# EAGLE design Centipedes (EAGLE 9.6.2)
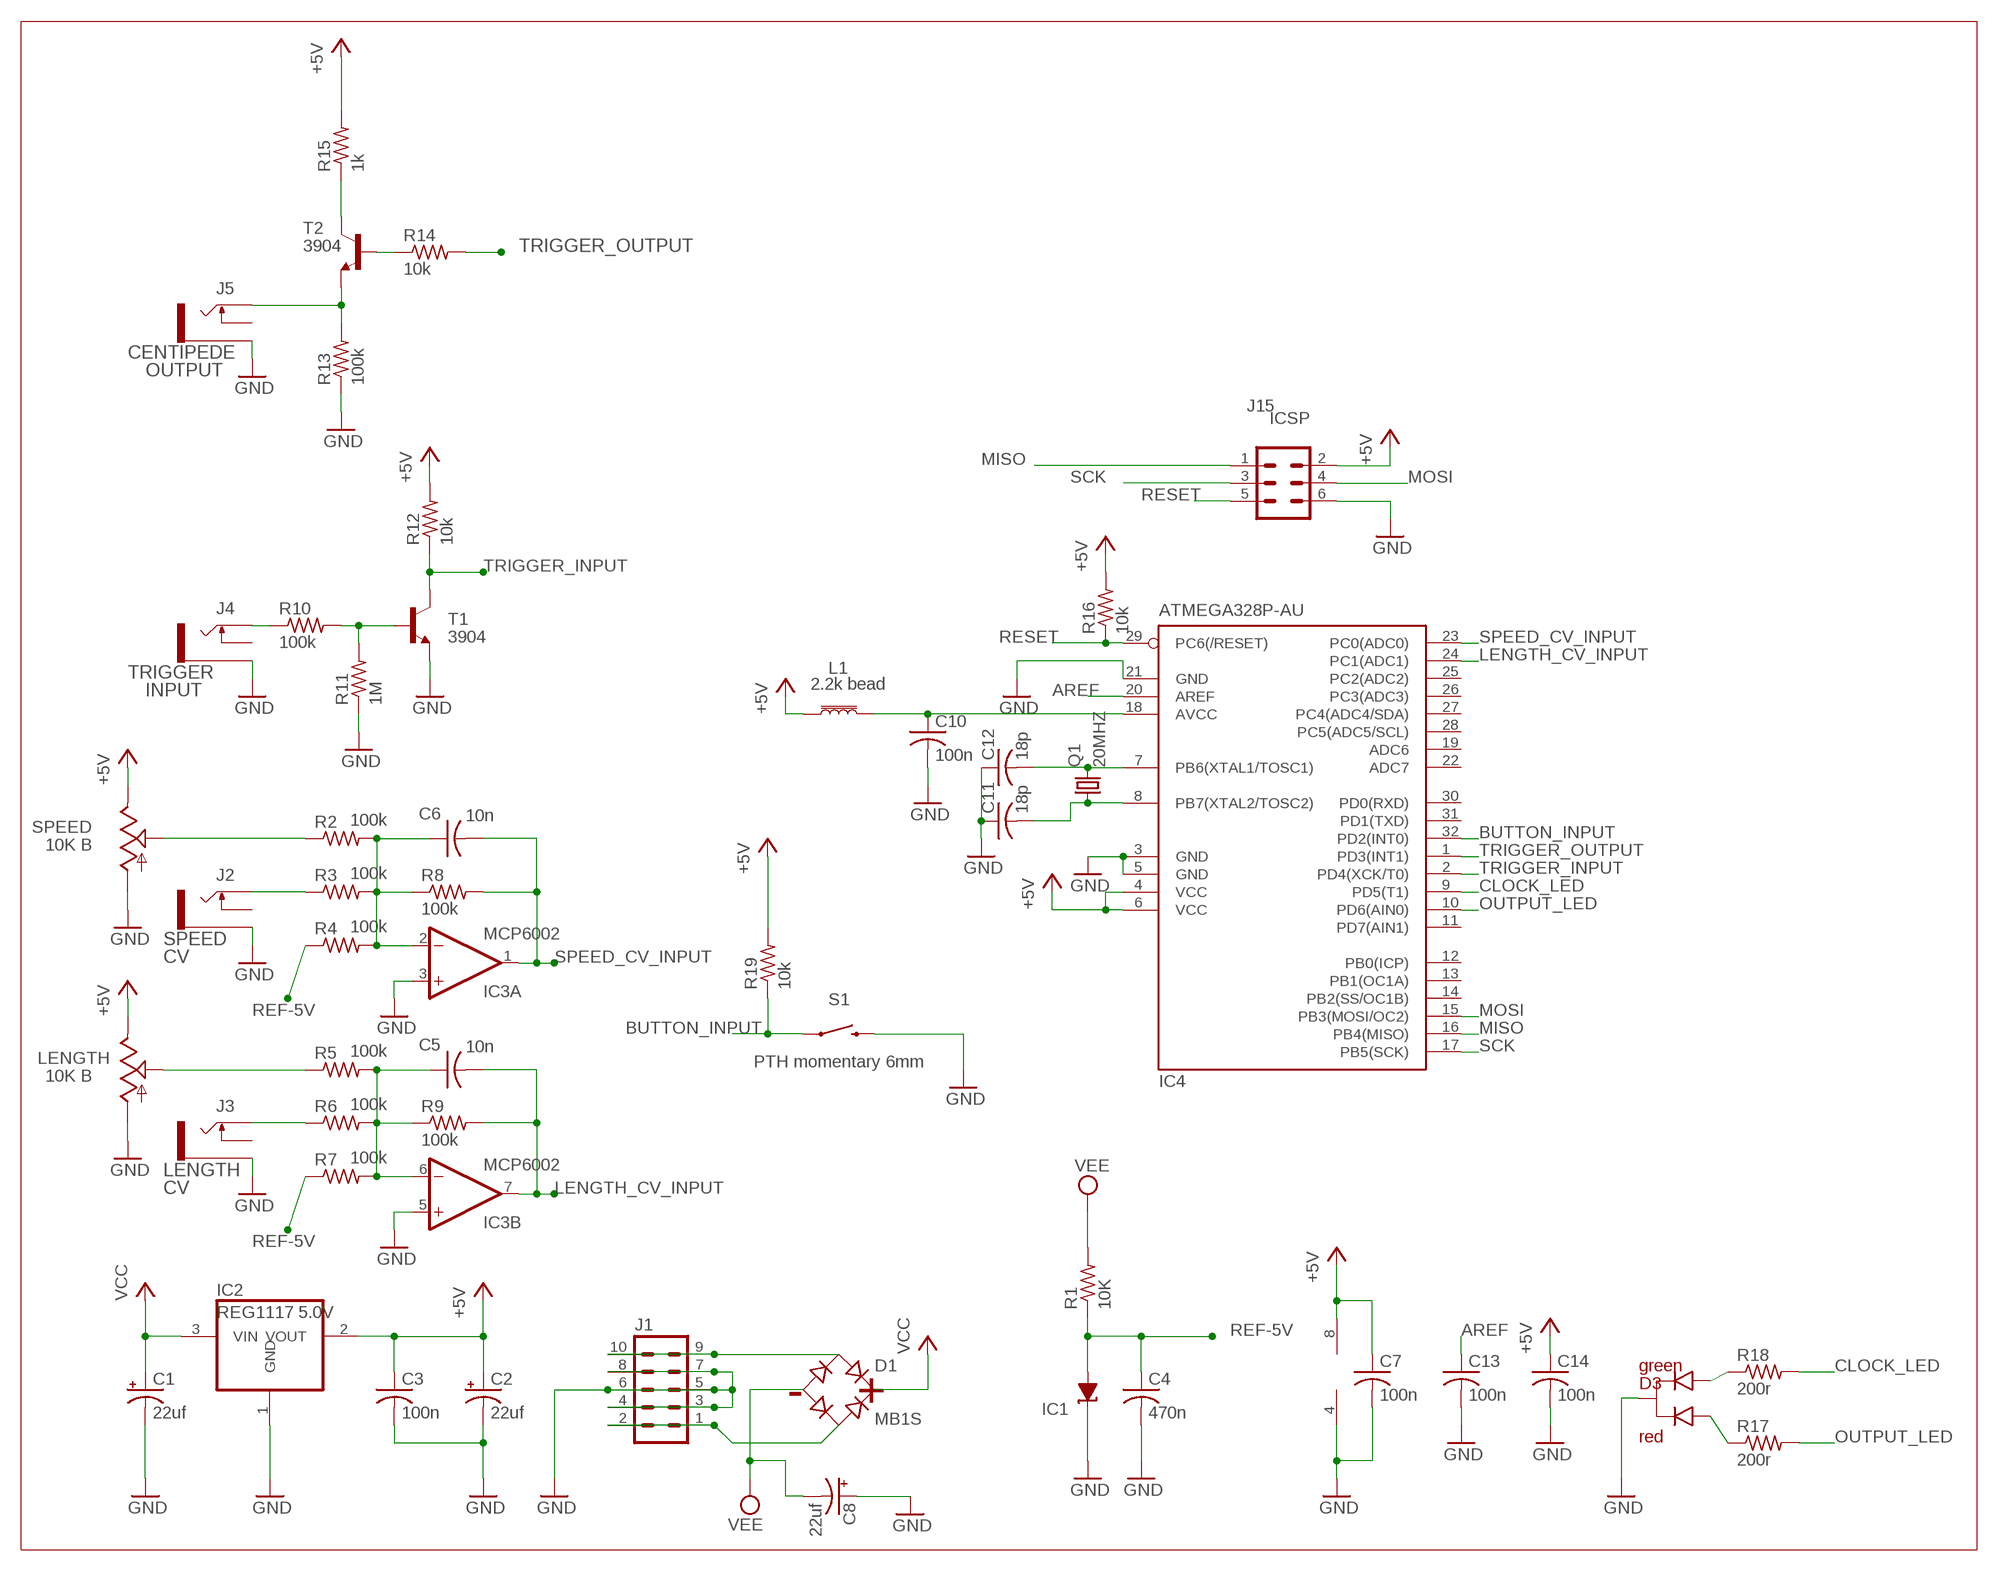
[diagram p0: schematic, sheet 1]

## Parts
C1  22uf  CPOL-USC  [PANASONIC_C]
C2  22uf  CPOL-USC  [PANASONIC_C]
C3  100n  C-USC0603K  [C0603K]
C4  470n  C-USC0603K  [C0603K]
C5  10n  C-USC0603K  [C0603K]
C6  10n  C-USC0603K  [C0603K]
C7  100n  C-USC0603K  [C0603K]
C8  22uf  CPOL-USC  [PANASONIC_C]
C10  100n  C-USC0603K  [C0603K]
C11  18p  C-USC0603K  [C0603K]
C12  18p  C-USC0603K  [C0603K]
C13  100n  C-USC0603K  [C0603K]
C14  100n  C-USC0603K  [C0603K]
D1  MB1S  [SOIC-4]
D3  LED-DUALCOLOR3MM-THROUGH-HOLE  [LED-DUALCOLOR-3MM]
IC1  LM4041A12DBZ  [DBZ_R-PDSO-G3]
IC2  REG1117 5.0V  REG1117  [SOT223]
IC3  MCP6002  MCP6002_  [SO08]
IC4  ATMEGA328P-AU  MEGA8-AI  [TQFP32-08]
J1  MA05-2  [MA05-2]
J2  THONKICONNNEW  [WQP-PJ301M-12_JACK]
J3  THONKICONNNEW  [WQP-PJ301M-12_JACK]
J4  THONKICONNNEW  [WQP-PJ301M-12_JACK]
J5  THONKICONNNEW  [WQP-PJ301M-12_JACK]
J15  ICSP  MA03-2  [MA03-2]
L1  2.2k bead  FERRITE_BEAD-0603  [0603]
LENGTH  10K B  9MM_SNAP-IN_POT_  [9MM_SNAP-IN_POT]
Q1  20MHZ  CRYSTALHC49UP  [HC49UP]
R1  10K  R-US_R0603  [R0603]
R2  100k  R-US_R0603  [R0603]
R3  100k  R-US_R0603  [R0603]
R4  100k  R-US_R0603  [R0603]
R5  100k  R-US_R0603  [R0603]
R6  100k  R-US_R0603  [R0603]
R7  100k  R-US_R0603  [R0603]
R8  100k  R-US_R0603  [R0603]
R9  100k  R-US_R0603  [R0603]
R10  100k  R-US_R0603  [R0603]
R11  1M  R-US_R0603  [R0603]
R12  10k  R-US_R0603  [R0603]
R13  100k  R-US_R0603  [R0603]
R14  10k  R-US_R0603  [R0603]
R15  1k  R-US_R0603  [R0603]
R16  10k  R-US_R0603  [R0603]
R17  200r  R-US_R0603  [R0603]
R18  200r  R-US_R0603  [R0603]
R19  10k  R-US_R0603  [R0603]
S1  PTH momentary 6mm  MOMENTARY-SWITCH-SPST-PTH-6.0MM  [TACTILE_SWITCH_PTH_6.0MM]
SPEED  10K B  9MM_SNAP-IN_POT_  [9MM_SNAP-IN_POT]
T1  3904  MMBT3904LT1-NPN-SOT23-BEC  [SOT23-BEC]
T2  3904  MMBT3904LT1-NPN-SOT23-BEC  [SOT23-BEC]

## Nets
+5V: C2.+ C3.1 C7.1 C14.1 IC2.2(VOUT) IC3.8(P:V+) IC4.4(VCC) IC4.6(VCC) J15.2 L1.1 LENGTH.3(E) R12.2 R15.2 R16.2 R19.2 SPEED.3(E)
AREF: C13.1 IC4.20(AREF)
BUTTON_INPUT: IC4.32(PD2(INT0)) R19.1 S1.1
CLOCK_LED: IC4.9(PD5(T1)) R18.2
GND: C1.- C2.- C3.2 C4.2 C7.2 C8.+ C10.2 C11.1 C12.1 C13.2 C14.2 D3.K IC1.1(C) IC2.1(GND) IC3.3(A:+IN) IC3.4(P:V-) IC3.5(B:+IN) IC4.3(GND) IC4.5(GND) IC4.21(GND) J1.3 J1.4 J1.5 J1.6 J1.7 J1.8 J2.P$3_SLEEVE(SLEEVE) J3.P$3_SLEEVE(SLEEVE) J4.P$3_SLEEVE(SLEEVE) J5.P$3_SLEEVE(SLEEVE) J15.6 LENGTH.1(A) R11.1 R13.1 S1.3 SPEED.1(A) T1.E
LENGTH_CV_INPUT: C5.2 IC3.7(B:OUT) IC4.24(PC1(ADC1)) R9.2
MISO: IC4.16(PB4(MISO)) J15.1
MOSI: IC4.15(PB3(MOSI/OC2)) J15.4
N$1: LENGTH.2(S) R5.1
N$2: C5.1 IC3.6(B:-IN) R5.2 R6.2 R7.2 R9.1
N$3: J3.P$1_TIP(TIP) R6.1
N$4: D1.~2(AC2) J1.1 J1.2
N$5: D1.~1(AC1) J1.9 J1.10
N$6: J4.P$1_TIP(TIP) R10.1
N$7: C6.1 IC3.2(A:-IN) R2.2 R3.2 R4.2 R8.1
N$8: R10.2 R11.2 T1.B
N$9: J2.P$1_TIP(TIP) R3.1
N$10: R2.1 SPEED.2(S)
N$11: J5.P$1_TIP(TIP) R13.2 T2.E
N$12: R15.1 T2.C
N$13: R14.1 T2.B
N$14: C12.2 IC4.7(PB6(XTAL1/TOSC1)) Q1.2
N$15: C11.2 IC4.8(PB7(XTAL2/TOSC2)) Q1.1
N$16: D3.A1 R18.1
N$17: C10.1 IC4.18(AVCC) L1.2
N$18: D3.A2 R17.1
OUTPUT_LED: IC4.10(PD6(AIN0)) R17.2
REF-5V: C4.1 IC1.2(A) R1.1 R4.1 R7.1
RESET: IC4.29(PC6(/RESET)) J15.5 R16.1
SCK: IC4.17(PB5(SCK)) J15.3
SPEED_CV_INPUT: C6.2 IC3.1(A:OUT) IC4.23(PC0(ADC0)) R8.2
TRIGGER_INPUT: IC4.2(PD4(XCK/T0)) R12.1 T1.C
TRIGGER_OUTPUT: IC4.1(PD3(INT1)) R14.2
VCC: C1.+ D1.+ IC2.3(VIN)
VEE: C8.- D1.- R1.2
Unconnected: IC4.11(PD7(AIN1)) IC4.12(PB0(ICP)) IC4.13(PB1(OC1A)) IC4.14(PB2(SS/OC1B)) IC4.19(ADC6) IC4.22(ADC7) IC4.25(PC2(ADC2)) IC4.26(PC3(ADC3)) IC4.27(PC4(ADC4/SDA)) IC4.28(PC5(ADC5/SCL)) IC4.30(PD0(RXD)) IC4.31(PD1(TXD)) J2.P$2_SWITCH(SWITCH) J3.P$2_SWITCH(SWITCH) J4.P$2_SWITCH(SWITCH) J5.P$2_SWITCH(SWITCH)

## Notes on the sheet
- CENTIPEDE
- OUTPUT
- TRIGGER
- INPUT
- SPEED
- CV
- LENGTH
- CV
- - | green
- D3
- +
- red

## Library data of the parts
C1 C2 C8 = rcl:CPOL-US: POLARIZED CAPACITOR, American symbol; SPICEPREFIX: C
C3-C7 C10-C14 = rcl:C-US: CAPACITOR, American symbol; SPICEPREFIX: C
D1 = rectifier:MB*S: Bridge Rectifier Source: http://www.fairchildsemi.com/ds/MB/MB6S.pdf
D3 = User-Submitted:LED-DUALCOLOR
IC1 = texas:LM4041: PRECISION MICROPOWER SHUNT VOLTAGE REFERENCE Source: http://focus.ti.com/lit/ds/slcs146e/slcs146e.pdf; MPN: LM4041A12IDBZR; OC_FARNELL: 1407949; OC_NEWARK: 58K5875
IC2 = burr-brown:REG1117: 800mA and 1A Low Dropout (LDO) Positive Regulator 1.8V, 2.5V, 2.85V, 3.3V, 5V, and Adj; MPN: REG1117; OC_FARNELL: 1097566; OC_NEWARK: 14P6981
IC3 = MusicThingModular:MCP6002: Generic Dual Op Amp
IC4 = atmel:MEGA8: MICROCONTROLLER 8 Kbytes FLASH, 1 kbytes SRAM, 512 bytes EEPROM, USART, 6-channel 10 bit ADC, 2-channel 8 bit ADC Pin compatible with Atmega48, ATMega88, ATMega168 Source: avr.lbr; MPN: ATMEGA8-16AU; OC_FARNELL: 9171371; OC_NEWARK: 73M8863
J1 = con-lstb:MA05-2: PIN HEADER; OC_FARNELL: unknown; OC_NEWARK: unknown
J2-J5 = MusicThingModular:THONKICONN: 3.5mm socket for Eurorack modular synths
J15 = con-lstb:MA03-2: PIN HEADER; OC_FARNELL: unknown; OC_NEWARK: unknown
L1 = SparkFun-Coils:FERRITE_BEAD: Ferrite Bead (blocks, cores, rings, chokes, etc.) Inductor with layers of ferrite used to suppress high frequencies. Often used to isolate high frequency noise. SparkFun Products: IOIO-OTG - V2.2 <https://www.sparkfun.com/products/13613> SparkFun SAMD21 Mini Breakout <https://www.sparkfun.com/products/13664> SparkFun 6 Degrees of Freedom Breakout - LSM6DS3 <https://www.sparkfun.com/products/13339> SparkFun SAMD21 Dev Breakout <https://www.sparkfun.com/products/13672> Lilypad MP3 <https://www.sparkfun.com/products/11013>; PROD_ID: NDUC-13805; VALUE: 30Ω/1.8A
LENGTH SPEED = MusicThingModular:9MM_SNAP-IN_POT: 9mm vertical snap-in pot, Alpha / Panasonic style
Q1 = crystal:CRYSTAL: CRYSTAL; OC_FARNELL: unknown; OC_NEWARK: unknown
R1-R19 = rcl:R-US_: RESISTOR, American symbol; SPICEPREFIX: R
S1 = SparkFun-Switches:MOMENTARY-SWITCH-SPST: Momentary Switch (Pushbutton) - SPST Normally-open (NO) SPST momentary switches (buttons, pushbuttons). Variants PTH-12MM - 12mm square, through-hole Momentary Pushbutton Switch - 12mm Square <https://www.sparkfun.com/products/9190> (COM-09190) PTH-6.0MM, PTH-6.0MM-KIT - 6.0mm square, through-hole Mini Pushbutton Switch <https://www.sparkfun.com/products/97> (COM-00097) KIT package intended for soldering kit's - only one side of pads' copper is exposed. PTH-RIGHT-ANGLE-KIT - Right-angle, through-hole Right Angle Tactile Button <https://www.sparkfun.com/products/10791> - Used on SparkFun BigTime Watch Kit <https://www.sparkfun.com/products/11734> SMD-12MM - 12mm square, surface-mount Tactile Button - SMD (12mm) <https://www.sparkfun.com/products/12993> (COM-12993) Used on SparkFun PicoBoard <https://www.sparkfun.com/products/11888> SMD-4.5MM - 4.5mm Square Trackball Switch Used on SparkFun Blackberry Trackballer Breakout <https://www.sparkfun.com/products/13169> SMD-4.6MMX2.8MM - 4.60mm x 2.80mm, surface mount Used on SparkFun Pro Micro - RP2040 <https://www.sparkfun.com/products/17717> SMD-5.2MM, SMD-5.2-REDUNDANT - 5.2mm square, surface-mount Mini Pushbutton Switch - SMD <https://www.sparkfun.com/products/8720> (COM-08720) Used on Arduino Pro Mini <https://www.sparkfun.com/products/11114> REDUNDANT package connects both switch circuits together SMD-6.0X3.5MM - 6.0 x 3.5mm, surface mount Momentary Reset Switch SMD <https://www.sparkfun.com/products/8229> (COM-08229) SMD-6.2MM-TALL - 6.2mm square, surface mount Tactile Button - SMD (6mm) <https://www.sparkfun.com/products/12992> Used on SparkFun Digital Sandbox <https://www.sparkfun.com/products/12651> SMD-RIGHT-ANGLE - Right-angle, surface mount Used on SparkFun Block for Intel® Edison - Arduino <https://www.sparkfun.com/products/13036>; PROD_ID: SWCH-08441; SF_SKU: COM-00097
T1 T2 = MusicThingModular:*-NPN-: NPN Transistror BF959 corrected 2008.03.06

## Module WP115VEGW
Ports: 

### Library data of the parts

## Board
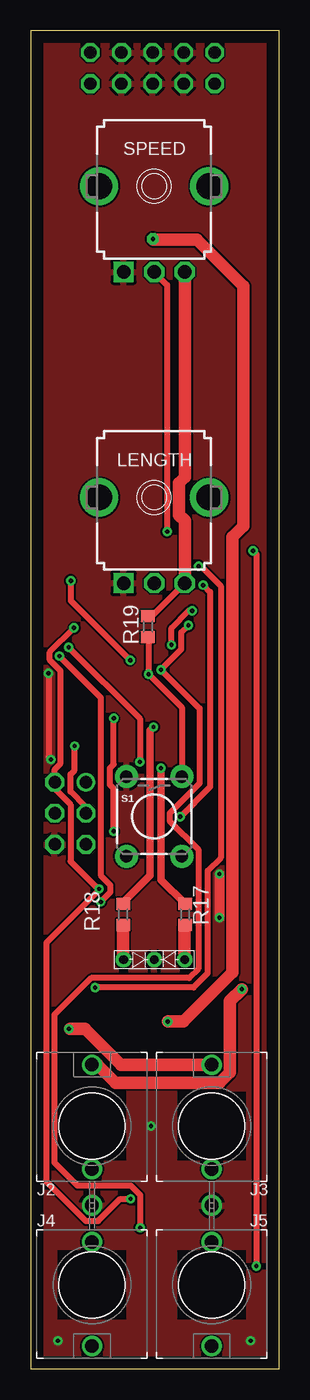
[diagram p1: board, top side]
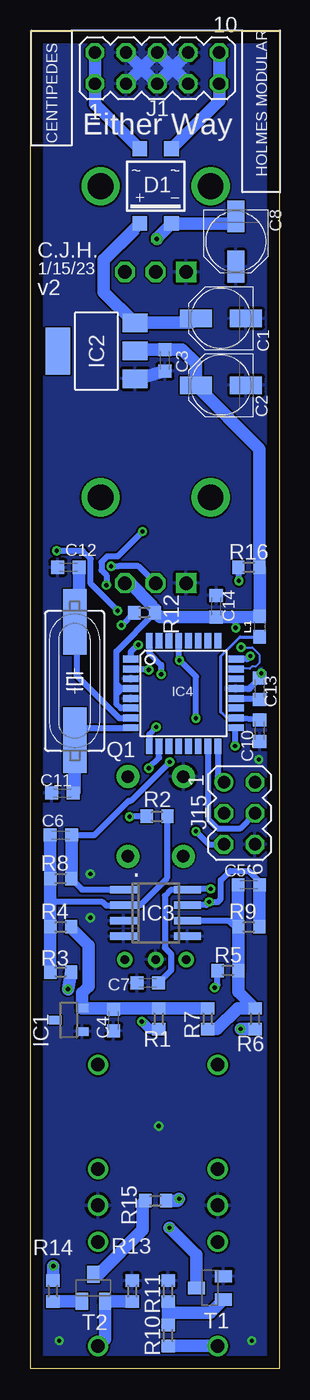
[diagram p2: board, bottom side, seen from below]

Size 20.31 x 109.21 mm. Coordinates in mm from the lower left corner, seen from the top.
Outline: 0,0 20.31,0 20.31,109.21 0,109.21 0,0
Copper layers (1*16): Top 0.035mm / dielectric 1.5mm / Bottom 0.035mm
Design rules "default": minimum track width 6mil, minimum drill 0.35mm, track to track 6mil, track to pad 6mil, pad to pad 6mil, via to via 6mil, smd to smd 6mil, copper to edge 40mil, drill to drill 6mil, minimum pad ring 10mil, minimum via ring 8mil, stop-mask expansion 4mil, vias tented up to drill 0mil, thermal gap 10mil
bRestrict: 30 lines

### Footprints (pad centres in the part's own frame; a part is rotated, then mirrored left to right if it is on the bottom)
PANASONIC_C = smd 2.6 x 1.4: + 2.05,0; - -2.05,0
C0603K = smd 1.05 x 1.08: 1 -0.875,0; 2 0.875,0
SOIC-4 = smd 1.2 x 1.2: + 1.3,3.05; - -1.3,3.05; ~1 -1.3,-3.05; ~2 1.3,-3.05
LED-DUALCOLOR-3MM = drill 0.7 pad 1.27: A1 -2.5,0; A2 2.5,0; K 0,0
DBZ_R-PDSO-G3 = smd 0.7 x 1: 1 -0.95,-1.1; 2 0.95,-1.1; 3 0,1.1
SOT223 = smd 1.499 x 2.007: 1 -2.261,-3.15; 2 0.025,-3.15; 3 2.311,-3.15 | smd 3.81 x 2.007: 4 0,3.15
SO08 = smd 0.6 x 2.2: 1 -1.905,-2.6; 2 -0.635,-2.6; 3 0.635,-2.6; 4 1.905,-2.6; 5 1.905,2.6; 6 0.635,2.6; 7 -0.635,2.6; 8 -1.905,2.6
TQFP32-08 = smd 1.27 x 0.559: 1 -4.293,2.8; 2 -4.293,2; 3 -4.293,1.2; 4 -4.293,0.4; 5 -4.293,-0.4; 6 -4.293,-1.2; 7 -4.293,-2; 8 -4.293,-2.8; 17 4.293,-2.8; 18 4.293,-2; 19 4.293,-1.2; 20 4.293,-0.4; 21 4.293,0.4; 22 4.293,1.2; 23 4.293,2; 24 4.293,2.8 | smd 0.559 x 1.27: 9 -2.8,-4.293; 10 -2,-4.293; 11 -1.2,-4.293; 12 -0.4,-4.293; 13 0.4,-4.293; 14 1.2,-4.293; 15 2,-4.293; 16 2.8,-4.293; 25 2.8,4.293; 26 2,4.293; 27 1.2,4.293; 28 0.4,4.293; 29 -0.4,4.293; 30 -1.2,4.293; 31 -2,4.293; 32 -2.8,4.293
MA05-2 = drill 1.016 octagon: 1 -5.08,-1.27; 2 -5.08,1.27; 3 -2.54,-1.27; 4 -2.54,1.27; 5 0,-1.27; 6 0,1.27; 7 2.54,-1.27; 8 2.54,1.27; 9 5.08,-1.27; 10 5.08,1.27
WQP-PJ301M-12_JACK = drill 1.1: P$1_TIP 0,5; P$2_SWITCH 0,-3.5; P$3_SLEEVE 0,-6.5
MA03-2 = drill 1.016: 1 -2.54,-1.27 | drill 1.016 octagon: 2 -2.54,1.27; 3 0,-1.27; 4 0,1.27; 5 2.54,-1.27; 6 2.54,1.27
0603 = smd 1.1 x 1: 1 -0.85,0; 2 0.85,0
9MM_SNAP-IN_POT = drill 1.1 square: 1 -2.5,-7 | drill 1.1 octagon: 2 0,-7; 3 2.5,-7 | drill 2.1 pad 2.794: CHASSIS1 -4.5,0; CHASSIS2 4.5,0
HC49UP = smd 5.334 x 1.93: 1 -4.826,0; 2 4.826,0
R0603 = smd 1 x 1.1: 1 -0.85,0; 2 0.85,0
TACTILE_SWITCH_PTH_6.0MM = drill 1.016 pad 1.88: 1 -3.251,2.261; 2 3.251,2.261; 3 -3.251,-2.261; 4 3.251,-2.261
SOT23-BEC = smd 1 x 1.4: B -0.95,-1.1; C 0,1.1; E 0.95,-1.1

### Placement (x,y rotation side)
C1  4.76,85.72 180 bottom
C2  4.76,80.26 180 bottom
C3  9.33,82.3 270 bottom
C4  13.53,28.45 270 bottom
C5  2.48,39.5 0 bottom
C6  17.84,43.56 0 bottom
C7  10.73,31.5 180 bottom
C8  3.54,92 270 bottom
C10  1.59,52.07 270 bottom
C11  17.72,46.99 0 bottom
C12  17.21,65.41 0 bottom
C13  1.59,55.5 90 bottom
C14  5.14,62.23 90 bottom
D1  10.1,96.52 180 bottom
D3  10.1,33.4 0 top
IC1  17.18,28.47 90 bottom
IC2  14.92,83.06 90 bottom
IC3  10.1,37.21 270 bottom
IC4  7.81,55.12 0 bottom
J1  9.97,106.15 0 bottom
J2  5.02,19.81 0 top
J3  14.8,19.81 0 top
J4  5.02,6.86 180 top
J5  14.8,6.86 180 top
J15  3.24,45.34 270 bottom
L1  1.59,60.58 270 bottom
LENGTH  10.1,71.12 0 top
Q1  16.7,56.13 90 bottom
R1  9.84,28.57 270 bottom
R2  9.97,45.09 0 bottom
R3  17.84,32.38 180 bottom
R4  17.84,36.07 180 bottom
R5  4.18,32.51 0 bottom
R6  1.97,28.57 90 bottom
R7  5.84,28.57 270 bottom
R8  17.84,40.01 0 bottom
R9  2.48,36.07 0 bottom
R10  9.08,2.72 90 bottom
R11  9.08,6.35 270 bottom
R12  10.99,61.72 0 bottom
R13  12,6.35 270 bottom
R14  18.48,6.35 90 bottom
R15  10.1,13.72 0 bottom
R16  2.48,65.41 0 bottom
R17  12.64,37.08 90 top
R18  7.56,37.08 90 top
R19  9.59,60.58 90 top
S1  10.1,45.09 270 top
SPEED  10.1,96.52 0 top
T1  5.65,6.6 90 bottom
T2  15.18,6.6 0 bottom

### Tracks (layer width: path | path; a pad name or v marks a point on that pad's centre or on a via)
+5V  (via drill 0.35)
  Top 0.508: v8.17,13.87 7.31,13.87 5.53,12.08 4.51,12.08 1.28,15.31 1.28,34.76 5.6,39.08 v5.6,39.17 5.52,39.17 3.26,41.42 3.26,46.05 1.97,47.35 J15.2 1.97,48.93 2.45,49.41 2.45,56.96 1.56,57.84 1.56,58.5 v3.54,60.48 | LENGTH.3 9.91,61.43 R19.2
  Top 1.016: SPEED.3 12.6,72.77 12.12,72.29 12.12,69.69 12.6,69.22 LENGTH.3
  Bottom 0.152: 7.4,39.17 IC3.8 | 10.15,61.87 10.15,61.72 R12.2 10.15,61.87
  Bottom 0.508: v5.6,39.17 7.4,39.17 | C7.1 8.8,32.55 8.8,33.83 9.33,34.37 9.33,38.61 8.83,39.12 IC3.8 | IC4.6 12.94,53.92 13.3,54.28 13.3,55.07 | 13.3,55.07 12.85,55.52 IC4.4 12.93,55.52 13.3,55.88 | 13.3,55.07 13.3,55.88 | 13.3,55.88 13.3,58.56 R12.2 | v3.54,60.48 3.54,61.33 3.57,61.35
  Bottom 1.016: R15.2 8.32,13.72 v8.17,13.87 | IC2.2 11.69,83.17 C3.1 7.92,83.17 6.81,82.06 C2.+ 1.63,75.08 R16.2 1.59,65.37 L1.1 1.66,61.35 3.57,61.35 C14.1 9.75,61.34 R12.2 10.14,62 10.42,62.29 10.42,62.34 12.2,64.12 LENGTH.3
AREF
  Bottom 0.508: IC4.20 1.68,54.72 C13.1
BUTTON_INPUT  (via drill 0.35)
  Top 0.508: S1.1 12.36,53.98 v9.64,56.69 9.64,59.68 R19.1
  Bottom 0.508: IC4.32 10.61,58.43 9.64,57.45 v9.64,56.69
CLOCK_LED  (via drill 0.35)
  Top 0.61: R18.2 7.56,38.05 9.76,40.26 9.76,52.09 v10.05,52.38
  Bottom 0.508: IC4.9 10.61,51.81 v10.05,52.38
GND  (via drill 0.35)
  Top 0.508: v1.46,56.77 1.46,49.94 v1.66,49.73
  Top 0.813: v15.43,40.39 v15.43,36.83
  Bottom 0.508: C13.2 1.38,56.58 | IC4.21 2.43,55.52 C13.2 | C13.2 1.46,56.5 v1.46,56.77
  Bottom 1.016: IC2.1 11.52,80.8 C3.2 | J1.4 J1.5 J1.8 | J1.7 J1.6 J1.3
  other vias: 17.97,2.29 2.22,2.29 9.84,19.81
  pour Bottom: -0.06,0 -0.06,109.22 20.26,109.22 20.26,0
  pour Top: -0.06,109.22 -0.06,0 20.26,0 20.26,109.22
LENGTH_CV_INPUT  (via drill 0.35)
  Top 0.508: v2.35,58.17 5.73,54.79 5.73,40.28 6.51,39.49 6.51,38.88 v5.73,38.1
  Bottom 0.152: 1.61,36.12 R9.2
  Bottom 0.508: C5.2 1.6,39.77 2.48,40.64 4,40.64 4.76,39.88 4.76,38.35 5.02,38.1 v5.73,38.1 5.98,37.85 IC3.7 | v2.35,58.17 2.6,57.92 IC4.24
  Bottom 1.016: C5.2 1.6,36.13 1.61,36.12
MISO
  Bottom 0.508: IC4.16 5.01,48.38 J15.1
MOSI
  Bottom 0.508: J15.4 1.97,45.31 3.16,44.12 5.04,44.12 5.81,44.89 IC4.15
N$1  (via drill 0.35)
  Top 0.508: v13.73,65.51 13.92,65.51 15.53,63.9 15.53,41.71 14.47,40.64 14.47,32.27 13.31,31.11 v5.27,31.11
  Bottom 0.508: LENGTH.2 11.49,65.51 13.13,65.51 v13.73,65.51 | v5.27,31.11 5.03,31.36 R5.1
N$2
  Bottom 0.508: IC3.6 4.09,36.58 3.45,35.94 R9.1
  Bottom 1.016: R7.2 5.84,27.73 5.07,27.73 3.38,29.43 R6.2 3.33,30.78 R5.2 | C5.1 3.35,36.09 R9.1 R5.2 | R5.2
N$3  (via drill 0.35)
  Top 0.152: 3.24,27.74 v3.14,27.74
  Top 1.016: J3.P$1_TIP 7.37,24.81 4.45,27.74 3.24,27.74
  Bottom 1.016: R6.1 3.13,27.73 v3.14,27.74
N$4
  Bottom 1.016: J1.2 J1.1 15.05,103.22 D1.~2
N$5
  Bottom 1.016: J1.10 J1.9 4.89,103.48 D1.~1
N$6
  Bottom 1.016: R10.1 J4.P$1_TIP
N$7
  Bottom 0.152: 12.59,37.8 IC3.2 12.74,37.8
  Bottom 0.254: R4.2 18.69,38.1 | 18.69,43.54 C6.1
  Bottom 0.508: 18.69,38.1 14.41,38.1 14.11,37.8 12.74,37.8 | R2.2 9.18,45.02 9.18,40.03 11.42,37.8 12.59,37.8
  Bottom 1.016: R3.2 R4.2 R8.1 18.69,43.54
N$8
  Bottom 1.016: R10.2 9.08,4.57 | 9.08,4.57 R11.2 | T1.B 5.63,4.57 9.08,4.57
N$9  (via drill 0.35)
  Top 1.016: J2.P$1_TIP 5.46,24.81 6.95,23.33 15.41,23.33 16.28,24.2 16.28,30.01 v17.26,30.99
  Bottom 1.016: v17.26,30.99 R3.1
N$10  (via drill 0.35)
  Top 0.508: SPEED.2 11.16,88.45 v11.16,68.33 | v14.11,63.96 14.67,63.4 14.67,47.5 v12.23,45.06
  Bottom 0.508: R2.1 12.2,45.09 v12.23,45.06 | v14.11,63.96 14.11,64.78 14.51,65.18 14.51,65.83 14.05,66.29 13.2,66.29 v11.16,68.33
N$11
  Bottom 1.016: R13.2 T2.E 14.23,2.43 J5.P$1_TIP
N$12
  Bottom 0.152: 15.18,7.77 T2.C
  Bottom 1.016: R15.1 11.16,13.5 11.16,11.33 14.72,7.77 15.18,7.77
N$13
  Bottom 1.016: T2.B R14.1
N$14
  Bottom 0.152: 16.55,60.5 Q1.2
  Bottom 0.508: IC4.7 13.06,53.11 16.55,56.6 16.55,60.5
  Bottom 1.016: C12.2 16.33,61.33 Q1.2
N$15
  Bottom 0.152: 12.11,52.3 IC4.8 | 15.85,52.3 Q1.1
  Bottom 0.508: 15.85,52.3 12.11,52.3
  Bottom 1.016: C11.2 16.7,47.13 Q1.1
N$16
  Top 0.152: 7.56,33.53 D3.A1
  Top 1.016: 7.56,33.53 R18.1
N$17
  Bottom 0.254: IC4.18 4.29,53.12 4.76,53.59 4.76,58.17 3.2,59.73 L1.2
  Bottom 0.508: C10.1 IC4.18
N$18
  Top 0.152: 12.59,36.12 R17.1 | 12.59,33.53 D3.A2
  Top 1.016: 12.59,33.53 12.59,36.12
OUTPUT_LED  (via drill 0.35)
  Top 0.61: R17.2 10.66,39.91 v10.66,49.02
  Bottom 0.508: v10.66,49.02 9.81,49.87 IC4.10
REF-5V
  Bottom 0.152: 17.01,35.97 R4.1
  Bottom 1.016: R7.1 R1.1 13.42,29.43 C4.1 13.63,29.42 IC1.2 16.08,30.7 15.58,31.2 15.58,34.54 17.01,35.97
RESET  (via drill 0.35)
  Top 0.508: v3.29,64.31 3.29,62.69 v8.14,57.84 | v6.79,43.87 6.79,47.35 6.49,47.65 6.49,49.02 6.79,49.33 v6.79,53.09
  Bottom 0.152: 3.29,65.38 R16.1 | 8.19,59.36 IC4.29
  Bottom 0.508: v6.79,53.09 6.79,56.49 v8.14,57.84 8.19,57.89 8.19,59.36 | v3.29,64.31 3.29,65.38 | v6.79,43.87 5.73,42.8 J15.5
SCK  (via drill 0.35)
  Top 0.508: v3.59,50.83 3.59,48.85 3.26,48.52 3.26,47.12 4.51,45.87 J15.3
  Bottom 0.508: v3.59,50.83 3.59,52.24 IC4.17
SPEED_CV_INPUT  (via drill 0.35)
  Top 0.508: v3.11,58.88 8.93,53.06 v8.93,49.53
  Bottom 0.152: v3.11,58.88 2.2,58.88 1.61,58.29 1.61,57.61 1.92,57.3 2.22,57.3 2.37,57.15 3.44,57.15 IC4.23
  Bottom 0.508: R8.2 16.1,39.12 IC3.1 | v8.93,49.53 12.11,46.35 12.3,46.35 15.09,43.56 C6.2
  Bottom 1.016: C6.2 16.97,40.03 R8.2
TRIGGER_INPUT  (via drill 0.35)
  Top 0.508: v12.89,60.68 12.3,60.09 12.3,58.72 10.66,57.07 v10.66,57.05 13.8,53.9 13.8,47.78 11.37,45.34 11.37,44.73 13.7,42.39 13.7,32.65 12.95,31.9 4.95,31.9 1.94,28.9 1.94,16.84 3.82,14.96 8.18,14.96 8.95,14.19 v8.95,11.51
  Bottom 0.508: v12.89,60.68 v12.88,60.68 R12.1 | IC4.2 10.72,57.12 v10.66,57.05
  Bottom 1.016: T1.C 6.75,9.3 v8.95,11.51
TRIGGER_OUTPUT  (via drill 0.35)
  Top 0.508: v18.17,66.75 18.45,66.47 v18.45,8.38 | v11.52,59.08 11.52,60.48 12.92,61.87 v13.2,61.87
  Bottom 0.508: v11.52,59.08 11.55,59.08 12.1,58.53 IC4.1 | v13.2,61.87 15.4,64.08 15.4,66.11 16.04,66.75 v18.17,66.75
  Bottom 1.016: R14.2 18.48,8.36 v18.45,8.38
VCC
  Bottom 0.152: D1.+ 11.52,93.42 11.52,92.66 13.96,90.22 13.96,87.94 11.82,85.8 11.82,85.5 IC2.3
  Bottom 1.016: D1.+ 14.34,90.53 14.34,87.89 11.82,85.37 IC2.3 7.17,85.37 C1.+
VEE  (via drill 0.35, 0.35 pad 0.95)
  Top 1.016: v9.99,92.2 10.05,92.15 13.59,92.15 17.39,88.36 17.39,68.78 16.5,67.89 16.5,32.36 12.48,28.35 v11.21,28.35
  Bottom 0.152: 9.84,27.74 R1.2
  Bottom 0.813: v11.21,28.35 10.6,27.74 9.84,27.74
  Bottom 1.016: v9.99,92.2 9.99,92.27 D1.- 4.12,93.47 C8.-

### Text on the board
bNames: CENTIPEDES | Either Way | HOLMES MODULAR | C.J.H. | 1/15/23 | v2 | .